# EAGLE design MXP part (EAGLE 8.6.0)
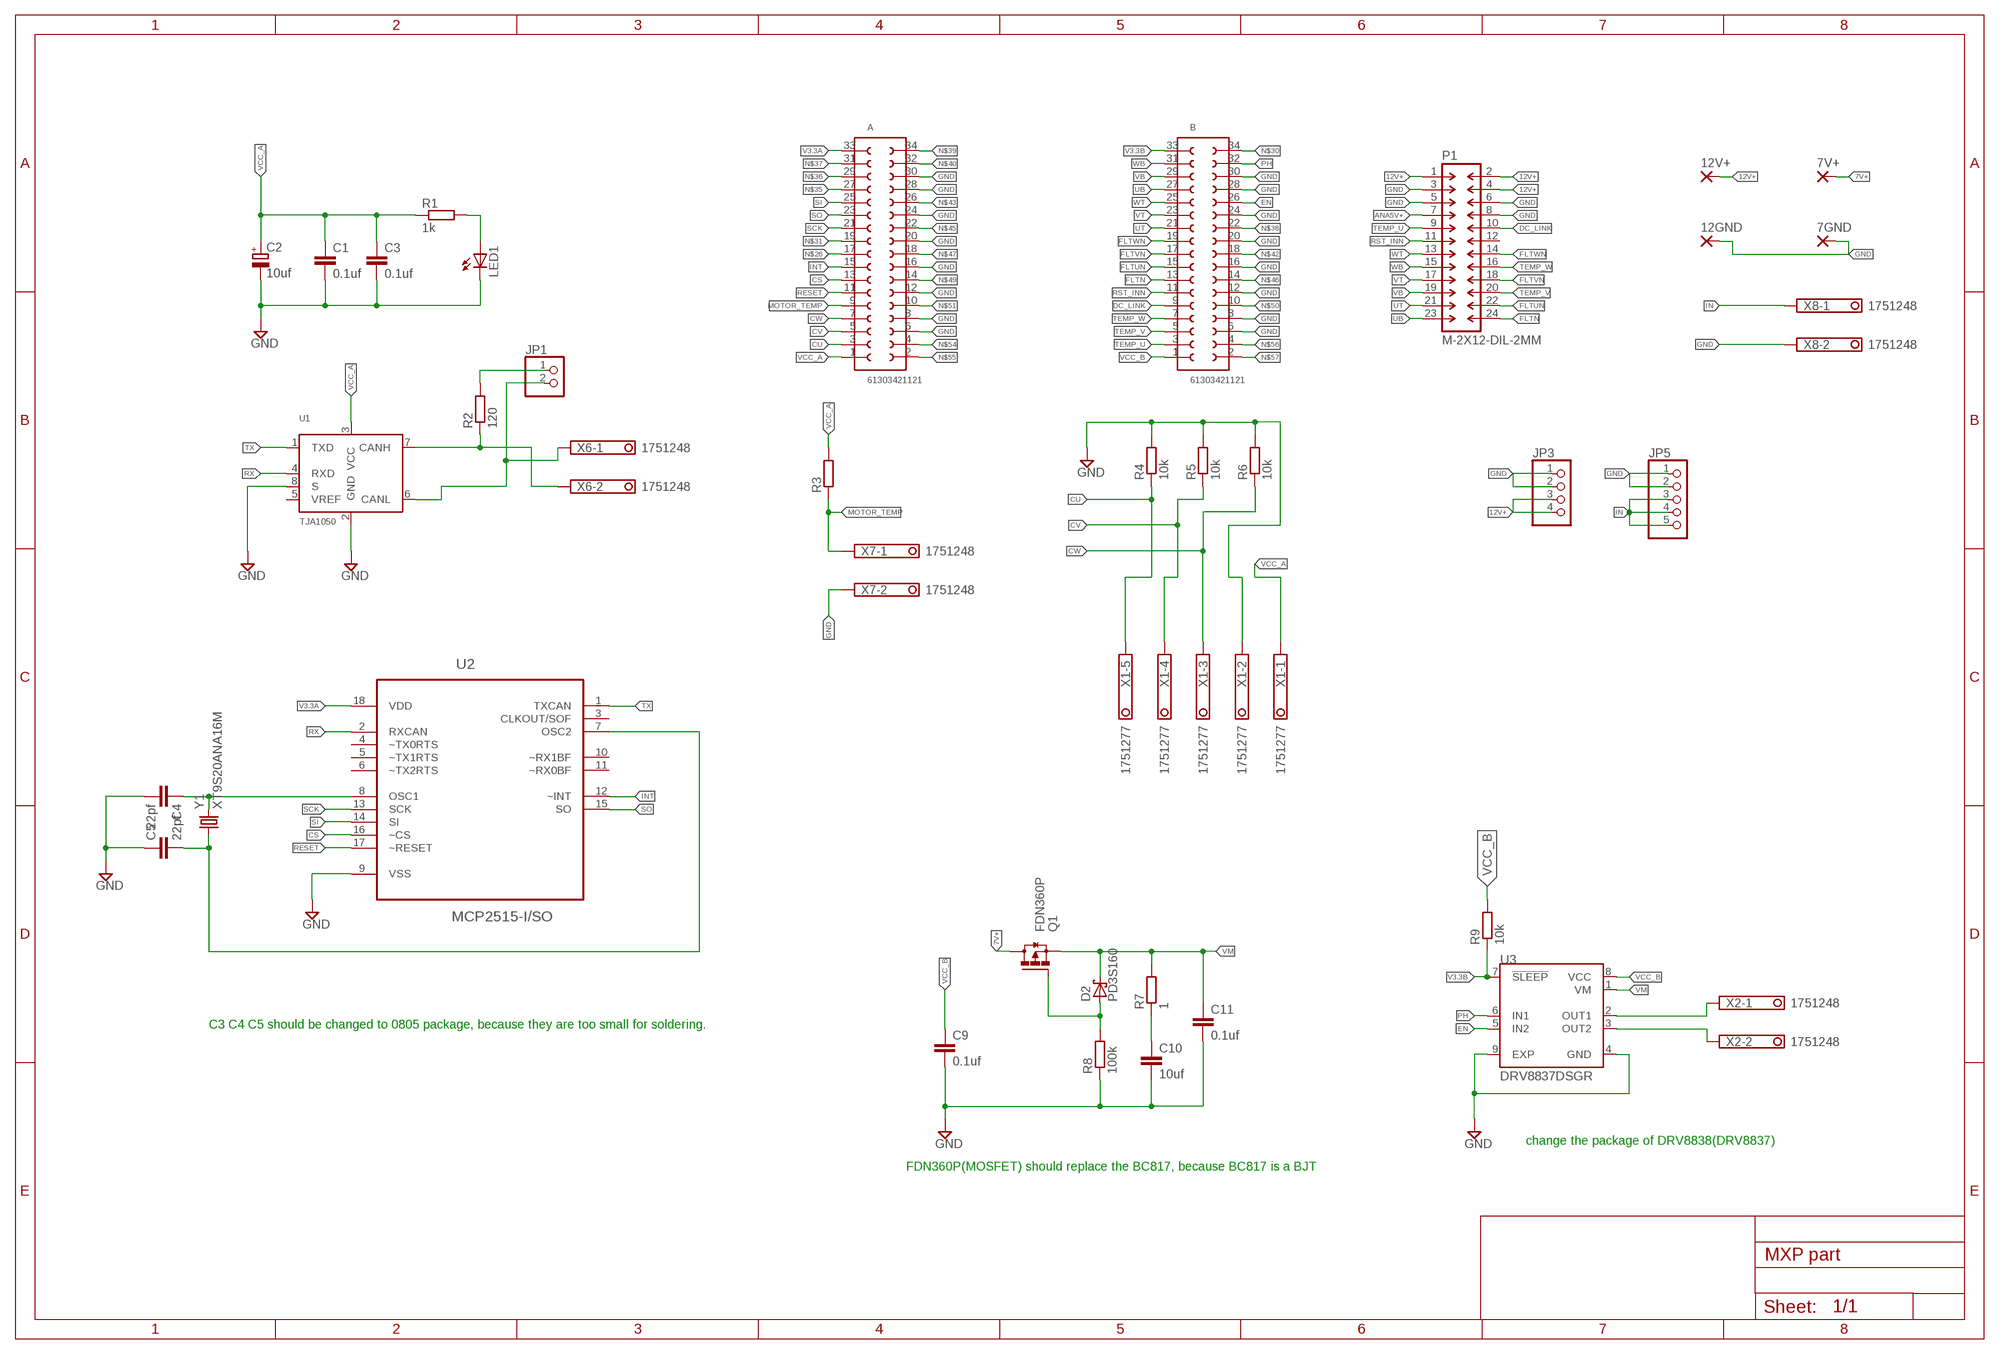
[diagram p0: schematic, sheet 1]

## Parts
7GND  2,54/0,9  [2,54/0,9]
7V+  2,54/0,9  [2,54/0,9]
12GND  2,54/0,9  [2,54/0,9]
12V+  2,54/0,9  [2,54/0,9]
A  61303421121  [61303421121]
B  61303421121  [61303421121]
C1  0.1uf  C-EUC0402K  [C0402K]
C2  10uf  CPOL-EUA/3216-18W  [A/3216-18W]
C3  0.1uf  C-EUC0402K  [C0402K]
C4  22pf  C-EUC0402K  [C0402K]
C5  22pf  C-EUC0402K  [C0402K]
C9  0.1uf  C-EUC0603K  [C0603K]
C10  10uf  C-EUC0603K  [C0603K]
C11  0.1uf  C-EUC0603K  [C0603K]
D2  PD3S160  [POWERDI323]
JP1  PINHD-1X2  [1X02]
JP3  PINHD-1X4  [1X04]
JP5  PINHD-1X5  [1X05]
LED1  LEDCHIP-LED0805  [CHIP-LED0805]
P1  M-2X12-DIL-2MM  [DIL-2MM-2X12]
Q1  FDN360P  [SUPER-SOT3]
R1  1k  R-EU_R0603  [R0603]
R2  120  R-EU_R0603  [R0603]
R3  R-EU_0204/7  [0204/7]
R4  10k  R-EU_0204/7  [0204/7]
R5  10k  R-EU_0204/7  [0204/7]
R6  10k  R-EU_0204/7  [0204/7]
R7  1  R-EU_R0603  [R0603]
R8  100k  R-EU_R0603  [R0603]
R9  10k  R-EU_R0603  [R0603]
U1  TJA1050  [SOT96-1]
U2  MCP2515-I/SO  [SOIC127P1034X264-18N]
U3  DRV8837DSGR  [SON50P200X200X80-9N]
X1  1751277  [1751277]
X2  1751248  [1751248]
X6  1751248  [1751248]
X7  1751248  [1751248]
X8  1751248  [1751248]
Y1  XT9S20ANA16M  [XTAL_XT9S20ANA16M]

## Nets
7V+: 7V+.1(P) Q1.3(D)
12V+: 12V+.1(P) JP3.3 JP3.4 P1.1 P1.2 P1.4
ANA5V+: P1.7
CS: A.13 U2.16(~CS)
CU: A.3 R4.1 X1.5
CV: A.5 R5.1 X1.4
CW: A.7 R6.1 X1.3
DC_LINK: B.9 P1.10
EN: B.26 U3.5(IN2)
FLTN: B.13 P1.24
FLTUN: B.15 P1.22
FLTVN: B.17 P1.18
FLTWN: B.19 P1.14
GND: 7GND.1(P) 12GND.1(P) A.6 A.8 A.12 A.16 A.20 A.24 A.28 A.30 B.6 B.8 B.12 B.16 B.20 B.24 B.28 B.30 C1.2 C2.- C3.2 C4.2 C5.1 C9.2 C10.2 C11.2 JP3.1 JP3.2 JP5.1 JP5.2 LED1.C P1.3 P1.5 P1.6 P1.8 R4.2 R5.2 R6.2 R8.1 U1.2(GND) U1.8(S) U2.9(VSS) U3.4(GND) U3.9(EXP) X1.2 X7.2 X8.2
IN: JP5.3 JP5.4 JP5.5 X8.1
INT: A.15 U2.12(~INT)
MOTOR_TEMP: A.9 R3.1 X7.1
N$1: C4.1 U2.8(OSC1) Y1.2
N$2: JP1.1 R2.2
N$3: C5.2 U2.7(OSC2) Y1.1
N$5: LED1.A R1.2
N$11: R2.1 U1.7(CANH) X6.2
N$12: JP1.2 U1.6(CANL) X6.1
N$15: U3.2(OUT1) X2.1
N$16: U3.3(OUT2) X2.2
N$19: D2.A Q1.1(G) R8.2
N$21: C10.1 R7.1
N$26: A.17
N$30: B.34
N$31: A.19
N$35: A.27
N$36: A.29
N$37: A.31
N$38: B.22
N$39: A.34
N$40: A.32
N$42: B.18
N$43: A.26
N$45: A.22
N$46: B.14
N$47: A.18
N$49: A.14
N$50: B.10
N$51: A.10
N$54: A.4
N$55: A.2
N$56: B.4
N$57: B.2
PH: B.32 U3.6(IN1)
RESET: A.11 U2.17(~RESET)
RST_INN: B.11 P1.11
RX: U1.4(RXD) U2.2(RXCAN)
SCK: A.21 U2.13(SCK)
SI: A.25 U2.14(SI)
SO: A.23 U2.15(SO)
TEMP_U: B.3 P1.9
TEMP_V: B.5 P1.20
TEMP_W: B.7 P1.16
TX: U1.1(TXD) U2.1(TXCAN)
UB: B.27 P1.23
UT: B.21 P1.21
V3.3A: A.33 U2.18(VDD)
V3.3B: B.33 R9.1 U3.7(!SLEEP)
VB: B.29 P1.19
VCC_A: A.1 C1.1 C2.+ C3.1 R1.1 R3.2 U1.3(VCC) X1.1
VCC_B: B.1 C9.1 R9.2 U3.8(VCC)
VM: C11.1 D2.C Q1.2(S) R7.2 U3.1(VM)
VT: B.23 P1.17
WB: B.31 P1.15
WT: B.25 P1.13
Unconnected: P1.12 U1.5(VREF) U2.3(CLKOUT/SOF) U2.4(~TX0RTS) U2.5(~TX1RTS) U2.6(~TX2RTS) U2.10(~RX1BF) U2.11(~RX0BF)

## Notes on the sheet
- C3 C4 C5 should be changed to 0805 package, because they are too small for soldering.
- change the package of DRV8838(DRV8837)
- FDN360P(MOSFET) should replace the BC817, because BC817 is a BJT

## Library data of the parts
7GND 7V+ 12GND 12V+ = wirepad:2,54/0,9: THROUGH-HOLE PAD
A B = 34pinsFemale:61303421121: WR-PHD 2.54mm Dual Pin Header, 34 Pins =>Code : Con_BTB_PHD_2.54_2_61303421121 <http://katalog.we-online.de/media/images/eican/Con_BTB_PHD_2.54_2_6130xx21121_pf2.jpg> Details see: http://katalog.we-online.de/en/em/613_0xx_211_21 Created 2014-05-29, Karrer Zheng 2014 (C) Würth Elektronik; AVAILABILITY: Warning; DESCRIPTION: CONN HEADER VERT DUAL 34POS 2.54; MF: Würth Elektronik; MP: 61303421121; PACKAGE: None; PRICE: 1.17 USD
C1 C3-C5 C9-C11 = rcl:C-EU: CAPACITOR, European symbol; SPICEPREFIX: C
C2 = rcl:CPOL-EU: POLARIZED CAPACITOR, European symbol; SPICEPREFIX: C
D2 = diode:PD3S160: 1.0A SURFACE MOUNT SCHOTTKY BARRIER RECTIFIER POWERDI ® 323 Source: http://www.diodes.com/datasheets/ds30899.pdf
JP1 = pinhead:PINHD-1X2: PIN HEADER
JP3 = pinhead:PINHD-1X4: PIN HEADER
JP5 = pinhead:PINHD-1X5: PIN HEADER
LED1 = adafruit:LED: LED OSRAM: - CHIPLED LG R971, LG N971, LY N971, LG Q971, LY Q971, LO R971, LY R971 LH N974, LH R974 LS Q976, LO Q976, LY Q976 LO Q996 - Hyper CHIPLED LW Q18S LB Q993, LB Q99A, LB R99A - SideLED LS A670, LO A670, LY A670, LG A670, LP A670 LB A673, LV A673, LT A673, LW A673 LH A674 LY A675 LS A676, LA A676, LO A676, LY A676, LW A676 LS A679, LY A679, LG A679 - Hyper Micro SIDELED® LS Y876, LA Y876, LO Y876, LY Y876 LT Y87S - SmartLED LW L88C, LW L88S LB L89C, LB L89S, LG L890 LS L89K, LO L89K, LY L89K LS L896, LA L896, LO L896, LY L896 - TOPLED LS T670, LO T670, LY T670, LG T670, LP T670 LSG T670, LSP T670, LSY T670, LOP T670, LYG T670 LG T671, LOG T671, LSG T671 LB T673, LV T673, LT T673, LW T673 LH T674 LS T676, LA T676, LO T676, LY T676, LB T676, LH T676, LSB T676, LW T676 LB T67C, LV T67C, LT T67C, LS T67K, LO T67K, LY T67K, LW E67C LS E67B, LA E67B, LO E67B, LY E67B, LB E67C, LV E67C, LT E67C LW T67C LS T679, LY T679, LG T679 LS T770, LO T770, LY T770, LG T770, LP T770 LB T773, LV T773, LT T773, LW T773 LH T774 LS E675, LA E675, LY E675, LS T675 LS T776, LA T776, LO T776, LY T776, LB T776 LHGB T686 LT T68C, LB T68C - Hyper Mini TOPLED® LB M676 - Mini TOPLED Santana® LG M470 LS M47K, LO M47K, LY M47K Source: http://www.osram.convergy.de/
P1 = con-headers-jp:M-2X12-: MALE HEADER
Q1 = transistor-power:FDN360P: Single P-Channel, PowerTrench (R) MOSFET Source: http://www.fairchildsemi.com/ds/FD/FDN360P.pdf
R1-R9 = rcl:R-EU_: RESISTOR, European symbol; SPICEPREFIX: R
U1 = NXP_60_26022015:TJA1050: High speed CAN transceiver The TJA1050 is the interface between the Controller Area Network (CAN) protocol controller and the physical bus. The device provides differential transmit capability to the bus and differential receive capability to the CAN controller. The TJA1050 is the third Philips high-speed CAN transceiver after the PCA82C250 and the PCA82C251. The most important differences are: Much lower electromagnetic emission due to optimal matching of the output signals CANH and CANL Improved behaviour in case of an unpowered node No standby mode. This makes the TJA1050 eminently suitable for use in nodes that are in a power-down situation in partially powered networks. AAL Eindhoven MK
U2 = MCP2515-I_SO:MCP2515-I/SO: CAN Controller; AVAILABILITY: Good; DESCRIPTION: IC CAN CONTROLLER W/SPI 18SOIC; MF: Microchip; MP: MCP2515-I/SO; PACKAGE: SOIC-18 Microchip; PRICE: 1.65 USD
U3 = DRV8837DSGR:DRV8837DSGR: DRV8837DSGR, DC Motor Driver IC see datasheet for more information datasheet <http://www.ti.com/lit/ds/symlink/drv8837.pdf>; AVAILABILITY: Good; DESCRIPTION: IC MOTOR DRIVER PAR 8WSON; MF: Texas Instruments; MP: DRV8837DSGR; PACKAGE: WSON-8 Texas Instruments; PRICE: 0.74 USD
X1 = con-phoenix-350:1751277: MKDS 1/ 5-3,5 Printklemme Nennstrom: 10 A Bemessungsspannung: 160 V Raster: 3,5 mm Polzahl: 5 Montageart: Löten Anschlussart: Schraubanschluss Anschlussrichtung vom Leiter zur Platine: 0° Source: http://eshop.phoenixcontact.com .. 1751277.pdf; OC_FARNELL: unknown; OC_NEWARK: unknown
X2 X6-X8 = con-phoenix-350:1751248: MKDS 1/ 2-3,5 Printklemme Nennstrom: 10 A Bemessungsspannung: 160 V Raster: 3,5 mm Polzahl: 2 Montageart: Löten Anschlussart: Schraubanschluss Anschlussrichtung vom Leiter zur Platine: 0° Source: http://eshop.phoenixcontact.com .. 1751248.pdf; OC_FARNELL: unknown; OC_NEWARK: unknown
Y1 = XT9S20ANA16M:XT9S20ANA16M: Microprocessor, Crystal; 16 MHz; + 30 ppm (Typ.) @ 25 degC; 7 pF (Max.); 40 Ohm; AVAILABILITY: Good; DESCRIPTION: Microprocessor, Crystal; 16 MHz; + 30 ppm (Typ.) @ 25 degC; 7 pF (Max.); 40 Ohm; MF: Vishay Dale; MP: XT9S20ANA16M; PACKAGE: None; PRICE: 0.32 USD

## Board
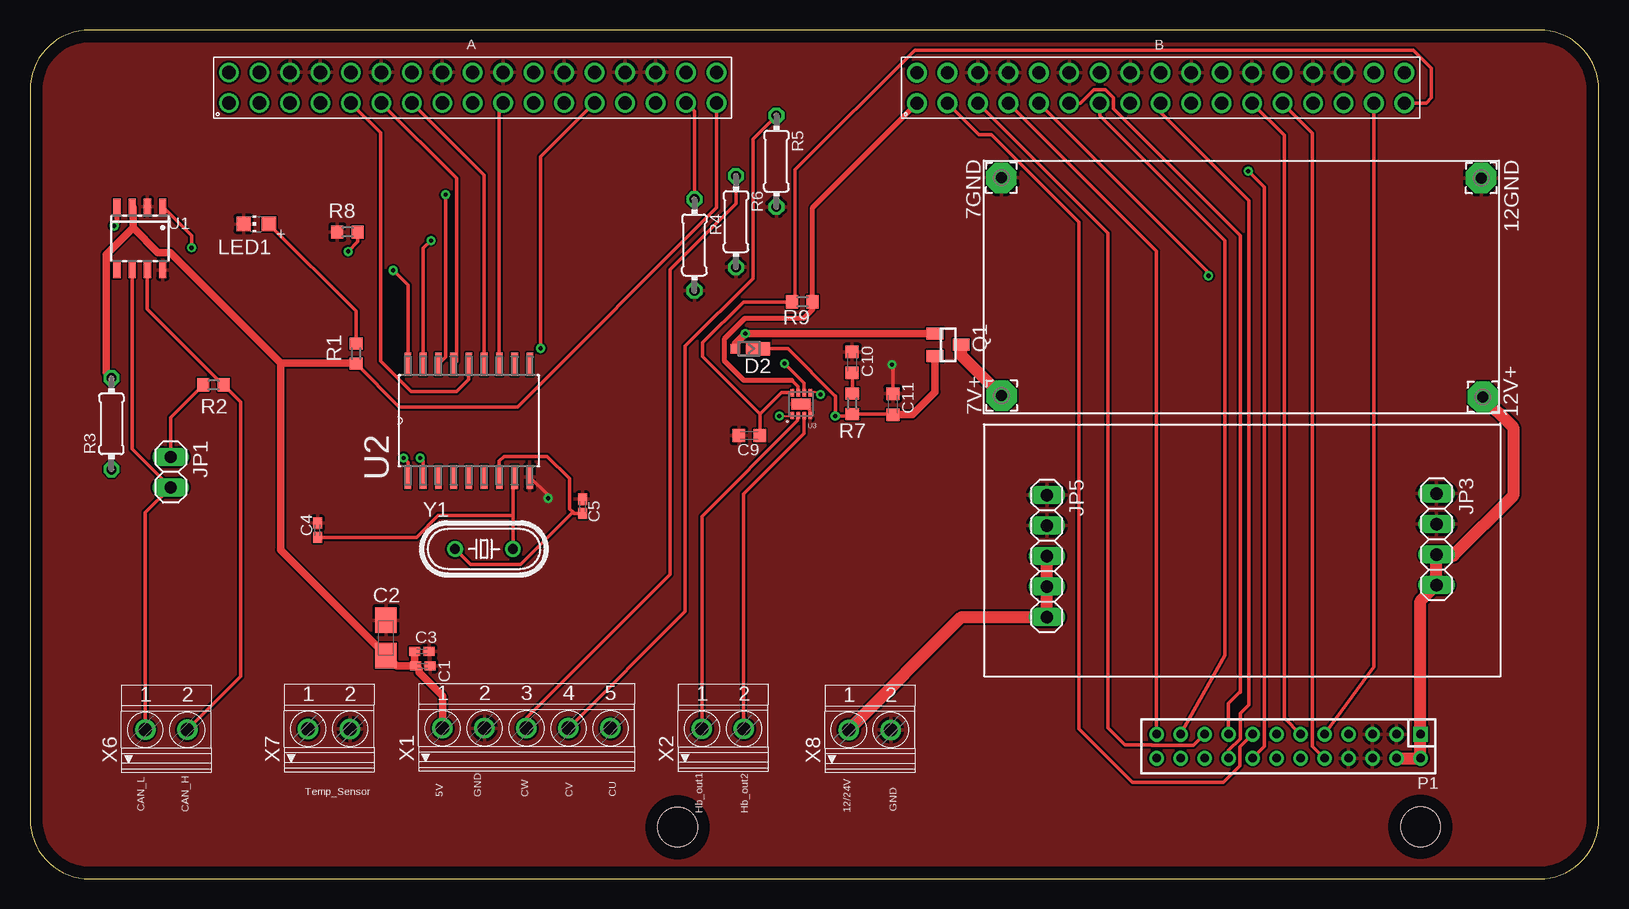
[diagram p1: board, top side]
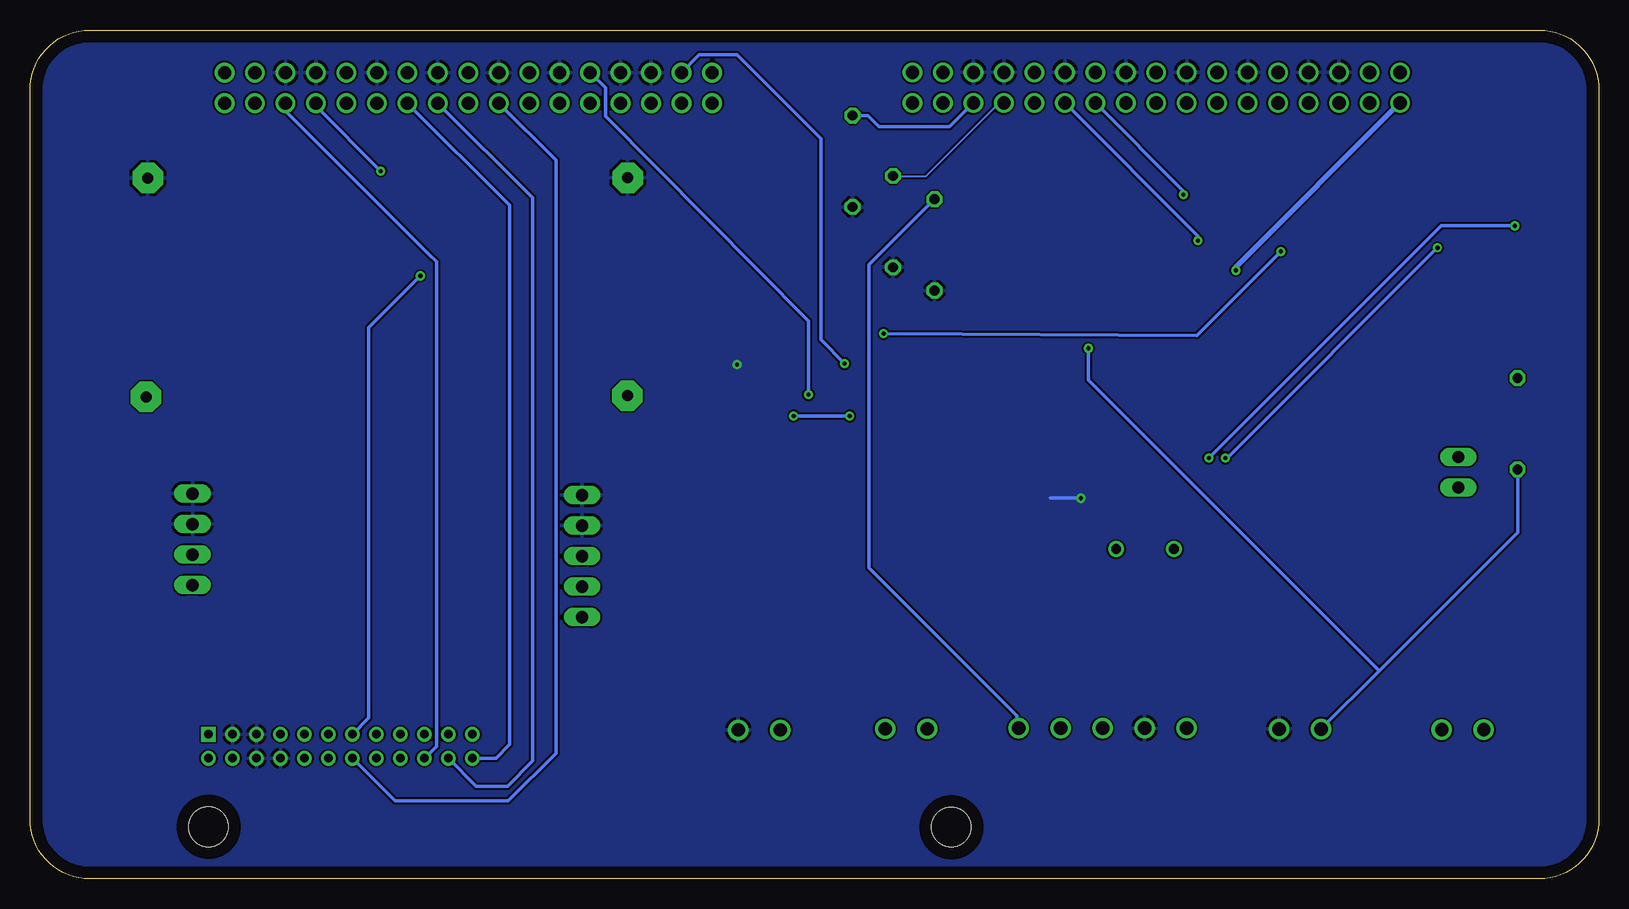
[diagram p2: board, bottom side, seen from below]

Size 130.79 x 70.79 mm. Coordinates in mm from the lower left corner, seen from the top.
Outline: 0,65.79 0,5 arc90 5,0 125.79,0 arc90 130.79,5 130.79,65.79 arc90 125.79,70.79 5,70.79 arc90 0,65.79
Copper layers (1*16): Top 0.035mm / dielectric 1.5mm / Bottom 0.035mm
Design rules "default": minimum track width 6mil, minimum drill 0.35mm, track to track 6mil, track to pad 6mil, pad to pad 6mil, via to via 6mil, smd to smd 6mil, copper to edge 40mil, drill to drill 6mil, minimum pad ring 10mil, minimum via ring 8mil, stop-mask expansion 4mil, vias tented up to drill 0mil, thermal gap 10mil
Holes 3.3 mm at 53.99,4.33 115.91,4.36

### Footprints (pad centres in the part's own frame; a part is rotated, then mirrored left to right if it is on the bottom)
2,54/0,9 = drill 0.914 pad 2.54 octagon: 1 0,0
61303421121 = drill 1.1: 1 20.32,-1.27; 2 20.32,1.27; 3 17.78,-1.27; 4 17.78,1.27; 5 15.24,-1.27; 6 15.24,1.27; 7 12.7,-1.27; 8 12.7,1.27; 9 10.16,-1.27; 10 10.16,1.27; 11 7.62,-1.27; 12 7.62,1.27; 13 5.08,-1.27; 14 5.08,1.27; 15 2.54,-1.27; 16 2.54,1.27; 17 0,-1.27; 18 0,1.27; 19 -2.54,-1.27; 20 -2.54,1.27; 21 -5.08,-1.27; 22 -5.08,1.27; 23 -7.62,-1.27; 24 -7.62,1.27; 25 -10.16,-1.27; 26 -10.16,1.27; 27 -12.7,-1.27; 28 -12.7,1.27; 29 -15.24,-1.27; 30 -15.24,1.27; 31 -17.78,-1.27; 32 -17.78,1.27; 33 -20.32,-1.27; 34 -20.32,1.27
C0402K = smd 0.925 x 0.74: 1 -0.6,0; 2 0.6,0
A/3216-18W = smd 2.15 x 1.8: + 1.475,0; - -1.475,0
C0603K = smd 1.05 x 1.08: 1 -0.875,0; 2 0.875,0
POWERDI323 = smd 0.8 x 0.8: A 1.15,0 | smd 2 x 1.1: C -0.75,0
1X02 = drill 1.016 long: 1 -1.27,0; 2 1.27,0
1X04 = drill 1.016 long: 1 -3.81,0; 2 -1.27,0; 3 1.27,0; 4 3.81,0
1X05 = drill 1.016 long: 1 -5.08,0; 2 -2.54,0; 3 0,0; 4 2.54,0; 5 5.08,0
CHIP-LED0805 = smd 1.2 x 1.2: A 0,-1.05; C 0,1.05
DIL-2MM-2X12 = drill 0.711 square: 1 -11,-1 | drill 0.711: 2 -11,1; 3 -9,-1; 4 -9,1; 5 -7,-1; 6 -7,1; 7 -5,-1; 8 -5,1; 9 -3,-1; 10 -3,1; 11 -1,-1; 12 -1,1; 13 1,-1; 14 1,1; 15 3,-1; 16 3,1; 17 5,-1; 18 5,1; 19 7,-1; 20 7,1; 21 9,-1; 22 9,1; 23 11,-1; 24 11,1
SUPER-SOT3 = smd 1 x 1.4: 1 -0.95,-1.1; 2 0.95,-1.1; 3 0,1.1
R0603 = smd 1 x 1.1: 1 -0.85,0; 2 0.85,0
0204/7 = drill 0.813 octagon: 1 -3.81,0; 2 3.81,0
SOT96-1 = smd 0.6 x 1.3: 1 -1.905,-2.65; 2 -0.635,-2.65; 3 0.635,-2.65; 4 1.905,-2.65; 5 1.905,2.65; 6 0.635,2.65; 7 -0.635,2.65; 8 -1.905,2.65
SOIC127P1034X264-18N = smd 1.981 x 0.559: 1 -4.699,5.08; 2 -4.699,3.81; 3 -4.699,2.54; 4 -4.699,1.27; 5 -4.699,0; 6 -4.699,-1.27; 7 -4.699,-2.54; 8 -4.699,-3.81; 9 -4.699,-5.08; 10 4.699,-5.08; 11 4.699,-3.81; 12 4.699,-2.54; 13 4.699,-1.27; 14 4.699,0; 15 4.699,1.27; 16 4.699,2.54; 17 4.699,3.81; 18 4.699,5.08
SON50P200X200X80-9N = smd 0.61 x 0.27: 1 -0.955,0.75; 2 -0.955,0.25; 3 -0.955,-0.25; 4 -0.955,-0.75; 5 0.955,-0.75; 6 0.955,-0.25; 7 0.955,0.25; 8 0.955,0.75 | smd 0.9 x 1.6: 9 0,0
1751277 = drill 1.1 pad 1.7: 1 -7,-0.1; 2 -3.5,-0.1; 3 0,-0.1; 4 3.5,-0.1; 5 7,-0.1
1751248 = drill 1.1 pad 1.7: 1 -1.75,-0.1; 2 1.75,-0.1
XTAL_XT9S20ANA16M = drill 0.813: 1 -2.413,0; 2 2.413,0

### Placement (x,y rotation side)
7GND  80.96,58.46 0 top
7V+  81,40.29 0 top
12GND  120.97,58.45 0 top
12V+  121.12,40.19 0 top
A  36.91,65.98 0 top
B  94.25,65.97 0 top
C1  32.74,17.77 0 top
C2  29.67,20.1 270 top
C3  32.66,18.98 0 top
C4  23.96,29.08 90 top
C5  46.06,31.07 270 top
C9  59.97,36.97 180 top
C10  68.53,43.07 90 top
C11  71.93,39.59 90 top
D2  59.94,44.21 180 top
JP1  11.73,33.93 270 top
JP3  117.24,28.32 270 top
JP5  84.76,26.92 270 top
LED1  18.86,54.62 90 top
P1  104.91,11.06 180 top
Q1  76.53,44.55 270 top
R1  27.19,43.81 90 top
R2  15.31,41.2 180 top
R3  6.79,37.96 90 top
R4  55.39,52.87 270 top
R5  62.22,59.85 270 top
R6  58.84,54.81 270 top
R7  68.54,39.64 270 top
R8  26.47,53.94 0 top
R9  64.38,48.12 180 top
U1  9.15,53.41 180 top
U2  36.58,38.22 90 top
U3  64.28,39.59 90 top
X1  41.38,12.67 0 top
X2  57.75,12.62 0 top
X6  11.36,12.55 0 top
X7  24.92,12.6 0 top
X8  70,12.53 0 top
Y1  37.84,27.52 0 top

### Tracks (layer width: path | path; a pad name or v marks a point on that pad's centre or on a via)
7V+
  Top 1.016: 7V+.1 77.62,43.66 Q1.3
12V+
  Top 0.152: 117.25,26.98 117.25,27.03 JP3.3 | 117.25,24.59 JP3.4
  Top 1.016: P1.4 P1.2 P1.1 115.91,23.17 JP3.4 117.24,26.98 117.25,26.98 118.66,26.98 123.63,31.95 123.63,37.68 12V+.1
CS  (via drill 0.35)
  Top 0.152: 34.04,43.03 U2.16
  Top 0.305: v34.65,57.05 34.65,43.52 U2.16
  Bottom 0.305: A.13 34.65,57.37 v34.65,57.05
CU
  Top 0.152: 55.37,56.74 R4.1
  Top 0.305: R4.1 55.39,64.01 A.3
  Bottom 0.152: 48.51,13.61 48.51,13.59 | 55.52,56.59 R4.1
  Bottom 0.305: X1.5 48.51,12.71 48.51,13.59 60.85,25.92 60.85,51.22 R4.1
CV
  Top 0.305: X1.4 54.61,22.3 54.61,44.45 60.27,50.07 60.27,61.67 R5.1
  Bottom 0.305: A.5 54.15,62.71 60,62.71 60.95,63.66 R5.1
CW
  Top 0.305: X1.3 41.38,13.44 53.34,25.4 53.34,50.8 58.84,56.3 R6.1
  Bottom 0.152: R6.1 58.73,58.57 56.13,58.57 50.04,64.67 49.73,64.67 A.7
DC_LINK
  Top 0.305: P1.10 106.92,11.06 106.92,62.19 B.9
EN  (via drill 0.35)
  Top 0.152: v65.9,40.39 65.75,40.55 65.43,40.59 65.13,40.59 U3.5
  Bottom 0.305: B.26 82.81,65.96 82.81,63.59 65.91,46.53 v65.9,40.39
FLTN
  Bottom 0.305: B.13 90.81,56.18 90.81,11.21 91.94,10.08 93.9,10.08 P1.24
FLTUN
  Bottom 0.305: B.15 | B.15 88.89,56.8 88.89,9.84 91,7.74 93.59,7.74 P1.22
FLTVN
  Top 0.305: B.17 94.25,63.91 101.61,56.55 101.61,14.54 100.89,13.82 100.89,11.7 99.91,10.72 P1.18
FLTWN
  Bottom 0.305: B.19 86.96,59.94 86.96,10.46 90.92,6.5 100.35,6.5 P1.14
GND  (via drill 0.35)
  Top 0.305: C11.2 71.93,42.52 71.89,42.56 71.89,42.85 v71.85,42.88 | U3.9 64.63,39.25 64.79,39.25 65.03,39.01 U3.4 | U2.9 43.18,32 v43.18,31.75
  Bottom 0.305: v71.85,42.88 v71.86,42.88 | v43.18,31.75 45.72,31.75
  pour Top: -1.27,72.39 132.08,72.39 132.08,-1.27 -1.27,-1.27
  pour Bottom: -1.27,72.39 132.08,72.39 132.08,-1.27 -1.27,-1.27
IN
  Top 1.016: X8.1 77.66,21.84 JP5.5 JP5.4 JP5.3
INT
  Top 0.305: U2.12 39.12,64.39 A.15
MOTOR_TEMP  (via drill 0.35)
  Top 0.305: v42.57,44.25 42.57,60.22 A.9
  Bottom 0.152: 6.76,34.04 R3.1
  Bottom 0.305: R3.1 6.79,28.88 18.33,17.34 | 18.33,17.34 X7.1 | v42.57,44.25 42.57,41.58 18.33,17.34
N$1
  Top 0.305: C4.1 32.21,28.48 34.02,30.29 40.19,30.29 40.25,30.36 | Y1.2 40.25,30.36 | 40.25,30.36 40.25,33.38 U2.8
N$2
  Top 0.305: JP1.1 11.73,38.48 R2.2
N$3
  Top 0.305: U2.7 39.12,34.84 39.51,35.23 43.12,35.23 44.96,33.38 44.96,30.87 45.25,30.58 | 45.25,30.58 45.37,30.47 C5.2 | Y1.1 36.73,26.22 40.88,26.22 45.25,30.58
N$5
  Top 0.305: LED1.A 27.19,47.34 R1.2
N$11
  Top 0.152: 16.2,41.11 16.2,41.2 R2.1
  Top 0.305: U1.7 9.79,47.52 16.2,41.11 | R2.1 17.57,39.79 17.57,16.91 X6.2
N$12
  Top 0.305: U1.6 8.52,35.87 JP1.2 | JP1.2 11.82,32.56 | JP1.2 9.62,30.54 X6.1
N$15
  Top 0.305: U3.2 63.97,38.58 63.97,38.21 56.01,30.24 X2.1
N$16
  Top 0.305: U3.3 64.53,37.15 59.48,32.1 59.48,12.55 X2.2
N$19  (via drill 0.35)
  Top 0.305: v26.52,52.32 27.32,53.13 R8.2
  Top 0.406: D2.A 58.79,44.47
  Top 0.61: D2.A 58.79,44.63 v59.63,45.47 75.4,45.47 Q1.1
  Bottom 0.305: v26.52,52.32 33.53,45.31 v59.63,45.47
N$21
  Top 0.305: R7.1 68.54,42.18 C10.1
PH  (via drill 0.35)
  Top 0.305: v62.89,42.99 64.54,41.34 U3.6
  Bottom 0.305: B.32 75,68.71 71.84,68.71 64.87,61.74 64.87,44.97 v62.89,42.99
RESET  (via drill 0.35)
  Top 0.152: 32.82,43.03 U2.17
  Top 0.305: U2.17 32.77,52.58 v33.43,53.24
  Bottom 0.305: A.11 33.43,53.61 v33.43,53.24
RST_INN
  Top 0.305: B.11 104.54,62.03 104.54,13.44 P1.11
RX  (via drill 0.35)
  Top 0.152: 7.21,55.98 U1.4 | 32.82,33.58 U2.2
  Top 0.305: v32.51,35.1 32.77,34.84 U2.2
  Top 0.406: U1.4 7.25,54.7 v7.01,54.46
  Bottom 0.305: v7.01,54.46 13.16,54.46 v32.51,35.1
SCK
  Top 0.152: 37.85,43.03 U2.13
  Top 0.305: U2.13 37.85,58.69 A.21
SI
  Top 0.152: 36.63,42.87 U2.14
  Top 0.305: A.25 26.75,64.69 29.21,62.23 29.21,43.51 29.21,43.18 31.75,40.64 35.56,40.64 36.58,41.66 U2.14 | 36.59,42.49 U2.14
SO
  Top 0.152: 35.26,43.03 U2.15 | 29.31,64.67 A.23
  Top 0.305: U2.15 35.56,43.16 35.56,58.42 29.29,64.69 A.23
TEMP_U
  Top 0.305: B.3 112.03,17.66 P1.9
TEMP_V
  Bottom 0.305: B.5 109.49,64.04 97.71,52.26 97.51,52.06 96.91,51.46 96.91,11.07 P1.20
TEMP_W  (via drill 0.35)
  Top 0.305: v101.55,59.03 102.91,57.67 102.91,11.06 P1.16
  Bottom 0.305: v101.55,59.03 106.95,64.43 B.7
TX  (via drill 0.35)
  Top 0.152: 31.45,33.58 U2.1
  Top 0.305: v13.46,52.63 13.46,53.66 U1.1 | v31.14,35.1 31.5,34.74 U2.1
  Bottom 0.305: v13.46,52.63 30.99,35.1 v31.14,35.1
UB
  Top 0.305: P1.23 93.91,52.33 B.27
UT
  Top 0.305: P1.21 99.61,18.63 99.61,53.23 89.17,63.65 B.21
V3.3A  (via drill 0.35)
  Top 0.152: 31.45,43.03 U2.18
  Top 0.305: v30.28,50.75 31.5,49.52 U2.18
  Bottom 0.406: A.33 30.28,51.02 v30.28,50.75
V3.3B
  Top 0.152: 65.28,48.21 65.27,48.18 R9.1
  Top 0.305: U3.7 64.03,41.06 63.52,41.58
  Top 0.406: 63.52,41.58 59.5,41.58 57.9,43.18 57.9,45.06 59.59,46.75 64.5,46.75 65.27,47.51 65.27,48.18 | R9.1 65.23,56 B.33
VB
  Top 0.305: B.29 89.85,53.86 89.85,12.6 91.28,11.17 93.51,11.17 93.54,11.15 97,11.15 P1.19
VCC_A
  Top 0.152: 27.18,43.03 R1.1 27.33,43.03 | 8.59,55.98 U1.3
  Top 0.305: R1.1 30.78,39.37 40.64,39.37 57.23,55.96 A.1
  Top 0.61: R3.2 6.35,42.21 6.35,52.07 8.59,54.3 | 8.59,54.3 8.59,55.98 | 8.59,54.3 10.66,52.24 11.68,52.24 20.89,43.03 | 20.89,43.03 27.18,43.03 | 20.89,43.03 20.89,27.44 C2.+ 30.56,17.77 C1.1 | C1.1 32.06,17.85 C3.1 | C1.1 32.42,17.49 32.42,17.21 34.38,15.26 X1.1
VCC_B
  Top 0.152: 63.45,40.59 U3.8
  Top 0.305: C9.1 60.85,38.77 | 60.85,38.77 62.64,40.56 63.52,40.56 U3.8 | 60.85,38.77 60.84,38.77 56.05,43.57 56.05,44.71 59.46,48.12 R9.2 63.78,48.37 63.78,59.13 73.76,69.11 115.31,69.11 116.82,67.59 116.82,65.14 116.38,64.69 B.1
VM  (via drill 0.35)
  Top 0.152: v62.46,38.61 63.45,38.61 U3.1 | 71.83,38.76 C11.1 | 60.71,44.25 D2.C
  Top 0.305: D2.C 63.18,44.21 67.11,40.28 67.13,40.27 v67.13,38.61 68.36,38.61 R7.2 71.86,38.79 C11.1
  Top 0.61: C11.1 73.55,38.71 75.44,40.6 75.44,43.58 Q1.2
  Bottom 0.305: v62.46,38.61 v67.13,38.61
VT
  Top 0.305: B.23 87.57,64.69 88.71,65.82 89.64,65.82 90.3,65.16 90.3,64.24 100.88,53.66 100.88,15.63 | 100.88,15.56 100.88,15.63 | P1.17 99.91,14.66 100.88,15.63
WB
  Top 0.305: B.31 79.1,62.06 80.14,62.06 87.43,54.78 87.43,12.52 91.88,8.06 99.49,8.06 100.86,9.43 100.86,11.01 P1.15
WT  (via drill 0.35)
  Top 0.305: B.25 98.25,50.54 v98.25,50.29
  Bottom 0.305: v98.25,50.29 102.54,46 102.54,13.44 P1.13

### Text on the board
tPlace: Temp_Sensor | 5V | GND | CW | CV | CU | CAN_L | CAN_H | Hb_out1 | Hb_out2 | 12/24V | GND